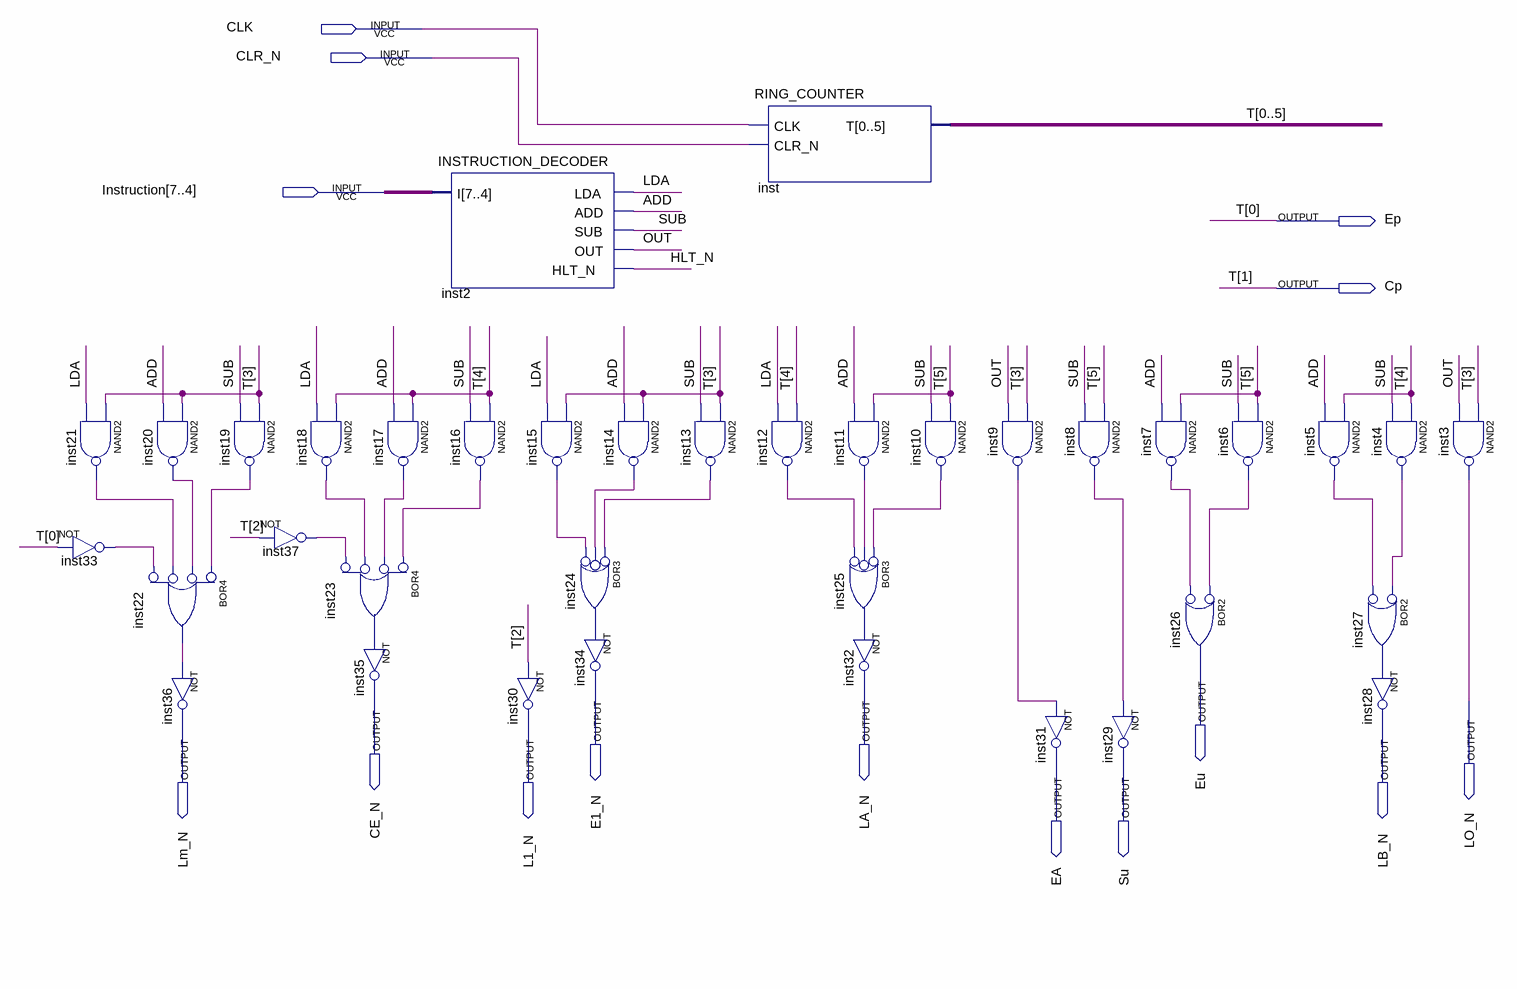
[diagram p0: schematic sheet]
// Quartus schematic CONTROL_MATRIX.bdf as structural Verilog: 37 symbols, 15 pins
module CONTROL_MATRIX (
  input  CLK,
  input  CLR_N,
  input  [7:4] Instruction,
  output Ep,
  output Cp,
  output Eu,
  output E1_N,
  output LA_N,
  output CE_N,
  output LO_N,
  output Lm_N,
  output L1_N,
  output LB_N,
  output EA,
  output Su
);

  wire ADD, HLT_N, inst4_out, inst5_out, inst6_out, inst7_out, inst8_out, inst9_out, inst10_out, inst11_out,
       inst12_out, inst13_out, inst14_out, inst15_out, inst16_out, inst17_out, inst18_out, inst19_out,
       inst20_out, inst21_out, inst22_out, inst23_out, inst24_out, inst25_out, inst27_out, inst33_out,
       inst37_out, LDA, OUT, SUB;
  wire [5:2] T;

  nand inst21 (inst21_out, T[3], LDA);
  not inst33 (inst33_out, Ep);
  nand inst20 (inst20_out, T[3], ADD);
  or inst22 (inst22_out, ~inst19_out, ~inst20_out, ~inst21_out, ~inst33_out);  // BOR4
  not inst36 (Lm_N, inst22_out);
  nand inst19 (inst19_out, T[3], SUB);
  not inst37 (inst37_out, T[2]);
  nand inst18 (inst18_out, T[4], LDA);
  or inst23 (inst23_out, ~inst16_out, ~inst17_out, ~inst18_out, ~inst37_out);  // BOR4
  not inst35 (CE_N, inst23_out);
  INSTRUCTION_DECODER inst2 (.I(Instruction), .LDA(LDA), .ADD(ADD), .SUB(SUB), .OUT(OUT), .HLT_N(HLT_N));
  nand inst17 (inst17_out, T[4], ADD);
  nand inst16 (inst16_out, T[4], SUB);
  not inst30 (L1_N, T[2]);
  nand inst15 (inst15_out, T[3], LDA);
  or inst24 (inst24_out, ~inst13_out, ~inst14_out, ~inst15_out);  // BOR3
  not inst34 (E1_N, inst24_out);
  nand inst14 (inst14_out, T[3], ADD);
  nand inst13 (inst13_out, T[3], SUB);
  RING_COUNTER inst (.CLK(CLK), .CLR_N(CLR_N), .T({Ep, Cp, T[2], T[3], T[4], T[5]}));
  nand inst12 (inst12_out, T[4], LDA);
  nand inst11 (inst11_out, T[5], ADD);
  or inst25 (inst25_out, ~inst10_out, ~inst11_out, ~inst12_out);  // BOR3
  not inst32 (LA_N, inst25_out);
  nand inst10 (inst10_out, T[5], SUB);
  nand inst9 (inst9_out, T[3], OUT);
  not inst31 (EA, inst9_out);
  nand inst8 (inst8_out, T[5], SUB);
  not inst29 (Su, inst8_out);
  nand inst7 (inst7_out, T[5], ADD);
  or inst26 (Eu, ~inst6_out, ~inst7_out);  // BOR2
  nand inst6 (inst6_out, T[5], SUB);
  nand inst5 (inst5_out, T[4], ADD);
  or inst27 (inst27_out, ~inst4_out, ~inst5_out);  // BOR2
  nand inst4 (inst4_out, T[4], SUB);
  not inst28 (LB_N, inst27_out);
  nand inst3 (LO_N, T[3], OUT);

  // Other names for the same wires on the sheet: T[1:0] = {Cp, Ep}
endmodule
